# Altium schematic sheet Amp_op4.SchDoc: AmpOps de Potência
size A3; Address1: UFCG; Address2: Laboratório VIRTUS CC; Address3: Campina Grande, PB - Brasil; SheetNumber: 6; SheetTotal: 7; Project: HAT RPi 4 - Phase Shifter Fotônico; Version: v1.0; SCH_SCALE: N/A
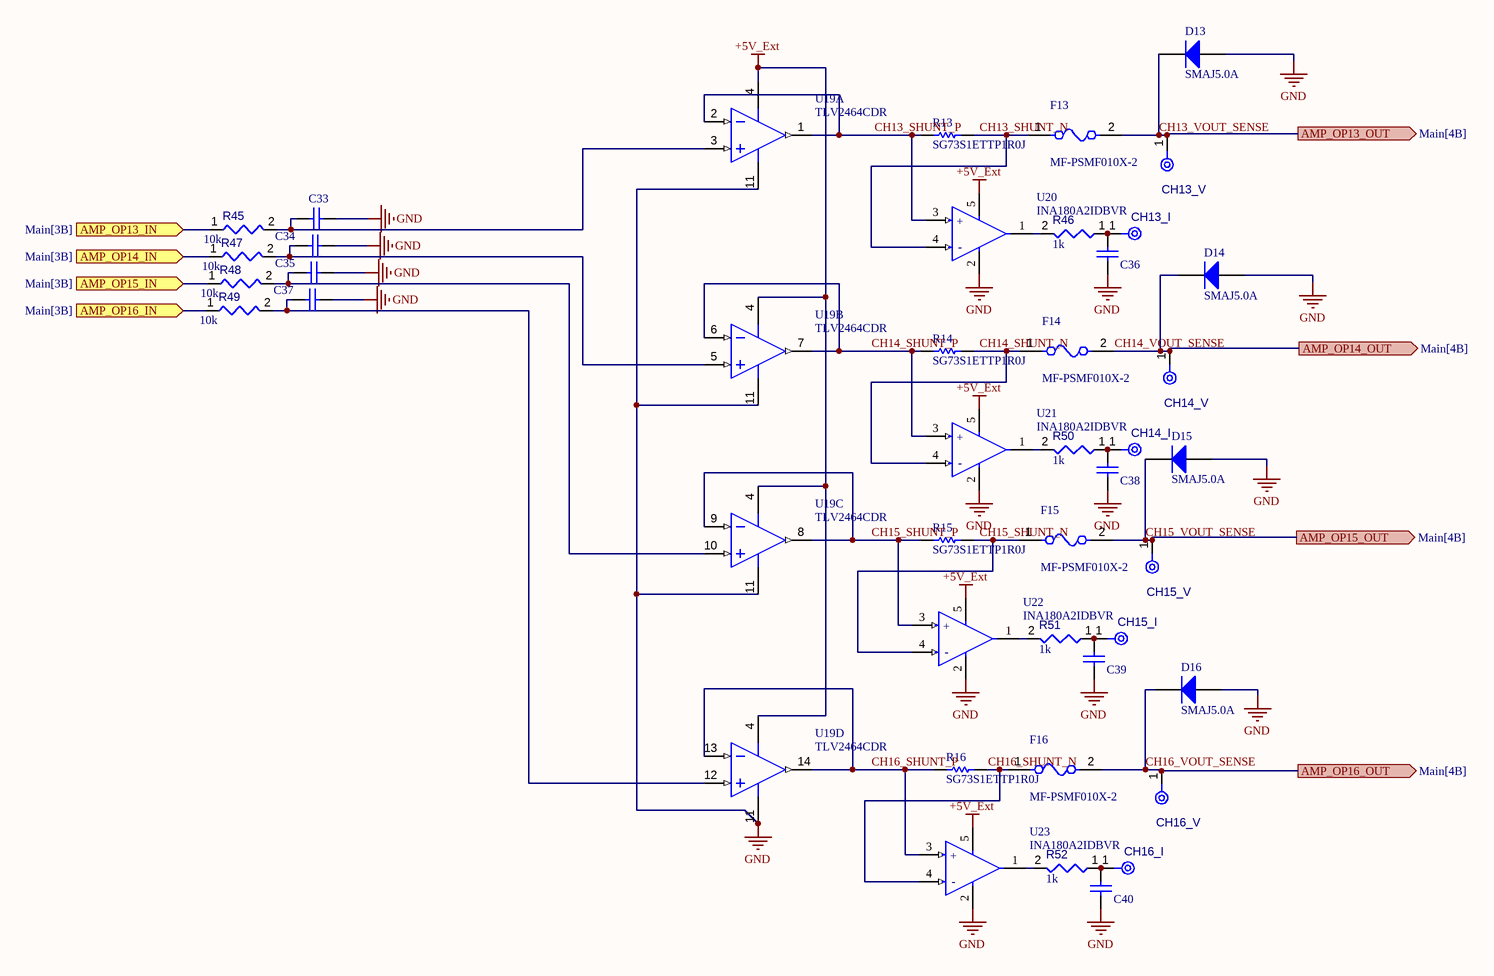
[diagram p0: Amp_op4.SchDoc]

## Parts
C33  VJ0603Y104MXJCW1BC  [CAPC1608X95X40NL15T15]  (value not drawn)
C34  VJ0603Y104MXJCW1BC  [CAPC1608X95X40NL15T15]  (value not drawn)
C35  VJ0603Y104MXJCW1BC  [CAPC1608X95X40NL15T15]  (value not drawn)
C36  VJ0603Y104MXJCW1BC  [CAPC1608X95X40NL15T15]  (value not drawn)
C37  VJ0603Y104MXJCW1BC  [CAPC1608X95X40NL15T15]  (value not drawn)
C38  VJ0603Y104MXJCW1BC  [CAPC1608X95X40NL15T15]  (value not drawn)
C39  VJ0603Y104MXJCW1BC  [CAPC1608X95X40NL15T15]  (value not drawn)
C40  VJ0603Y104MXJCW1BC  [CAPC1608X95X40NL15T15]  (value not drawn)
CH13_I  TPAD6R  [TP06R]  (value not drawn)  (no BOM)
CH13_V  TPAD6R  [TP06R]  (value not drawn)  (no BOM)
CH14_I  TPAD6R  [TP06R]  (value not drawn)  (no BOM)
CH14_V  TPAD6R  [TP06R]  (value not drawn)  (no BOM)
CH15_I  TPAD6R  [TP06R]  (value not drawn)  (no BOM)
CH15_V  TPAD6R  [TP06R]  (value not drawn)  (no BOM)
CH16_I  TPAD6R  [TP06R]  (value not drawn)  (no BOM)
CH16_V  TPAD6R  [TP06R]  (value not drawn)  (no BOM)
D13  SMAJ5.0A  [BOUR-SMA-2_V]
D14  SMAJ5.0A  [BOUR-SMA-2_V]
D15  SMAJ5.0A  [BOUR-SMA-2_V]
D16  SMAJ5.0A  [BOUR-SMA-2_V]
F13  MF-PSMF010X-2  [FP-MF-PSMF-MFG]
F14  MF-PSMF010X-2  [FP-MF-PSMF-MFG]
F15  MF-PSMF010X-2  [FP-MF-PSMF-MFG]
F16  MF-PSMF010X-2  [FP-MF-PSMF-MFG]
R13  SG73S1ETTP1R0J  [RESC1005X40X25LL10T10]
R14  SG73S1ETTP1R0J  [RESC1005X40X25LL10T10]
R15  SG73S1ETTP1R0J  [RESC1005X40X25LL10T10]
R16  SG73S1ETTP1R0J  [RESC1005X40X25LL10T10]
R45  value 10k  [RESC0603(1608)_L]  (hidden comment: Resistor 10k +/-1% 0603 100 mW)
R46  value 1k  [RESC0603(1608)_L]  (hidden comment: Resistor 1k +/-1% 0603 100 mW)
R47  value 10k  [RESC0603(1608)_L]  (hidden comment: Resistor 10k +/-1% 0603 100 mW)
R48  value 10k  [RESC0603(1608)_L]  (hidden comment: Resistor 10k +/-1% 0603 100 mW)
R49  value 10k  [RESC0603(1608)_L]  (hidden comment: Resistor 10k +/-1% 0603 100 mW)
R50  value 1k  [RESC0603(1608)_L]  (hidden comment: Resistor 1k +/-1% 0603 100 mW)
R51  value 1k  [RESC0603(1608)_L]  (hidden comment: Resistor 1k +/-1% 0603 100 mW)
R52  value 1k  [RESC0603(1608)_L]  (hidden comment: Resistor 1k +/-1% 0603 100 mW)
U19  TLV2464CDR  [D0014A_N]  (parts A,B,C,D of 4)
U20  INA180A2IDBVR  [FP-DBV0005A-MFG]
U21  INA180A2IDBVR  [FP-DBV0005A-MFG]
U22  INA180A2IDBVR  [FP-DBV0005A-MFG]
U23  INA180A2IDBVR  [FP-DBV0005A-MFG]

## Ports
AMP_OP13_IN (in, see Main[3B]), AMP_OP13_OUT (out, see Main[4B]), AMP_OP14_IN (in, see Main[3B]), AMP_OP14_OUT (out, see Main[4B]), AMP_OP15_IN (in, see Main[3B]), AMP_OP15_OUT (out, see Main[4B]), AMP_OP16_IN (in, see Main[3B]), AMP_OP16_OUT (out, see Main[4B])

## Nets
+5V_Ext: U19.4(VDD+) U20.5(VS) U21.5(VS) U22.5(VS) U23.5(VS)
GND: C33.2 C34.2 C35.2 C36.2 C37.2 C38.2 C39.2 C40.2 D13.1(A) D14.1(A) D15.1(A) D16.1(A) U19.11(GND) U20.2(GND) U21.2(GND) U22.2(GND) U23.2(GND)
AMP_OP13_IN: R45.1 ; port AMP_OP13_IN
AMP_OP14_IN: R47.1 ; port AMP_OP14_IN
AMP_OP15_IN: R48.1 ; port AMP_OP15_IN
AMP_OP16_IN: R49.1 ; port AMP_OP16_IN
CH13_SHUNT_N: F13.1 R13.2 U20.4(IN-)
CH13_SHUNT_P: R13.1 U19.1(OUT1) U19.2(IN1-) U20.3(IN+)
CH13_VOUT_SENSE: CH13_V.1(TP) D13.2(K) F13.2 ; port AMP_OP13_OUT
CH14_SHUNT_N: F14.1 R14.2 U21.4(IN-)
CH14_SHUNT_P: R14.1 U19.6(IN2-) U19.7(OUT2) U21.3(IN+)
CH14_VOUT_SENSE: CH14_V.1(TP) D14.2(K) F14.2 ; port AMP_OP14_OUT
CH15_SHUNT_N: F15.1 R15.2 U22.4(IN-)
CH15_SHUNT_P: R15.1 U19.8(OUT3) U19.9(IN3-) U22.3(IN+)
CH15_VOUT_SENSE: CH15_V.1(TP) D15.2(K) F15.2 ; port AMP_OP15_OUT
CH16_SHUNT_N: F16.1 R16.2 U23.4(IN-)
CH16_SHUNT_P: R16.1 U19.13(IN4-) U19.14(OUT4) U23.3(IN+)
CH16_VOUT_SENSE: CH16_V.1(TP) D16.2(K) F16.2 ; port AMP_OP16_OUT
NetC33_1: C33.1 R45.2 U19.3(IN1+)
NetC34_1: C34.1 R47.2 U19.5(IN2+)
NetC35_1: C35.1 R48.2 U19.10(IN3+)
NetC36_1: C36.1 CH13_I.1(TP) R46.1
NetC37_1: C37.1 R49.2 U19.12(IN4+)
NetC38_1: C38.1 CH14_I.1(TP) R50.1
NetC39_1: C39.1 CH15_I.1(TP) R51.1
NetC40_1: C40.1 CH16_I.1(TP) R52.1
NetR46_2: R46.2 U20.1(OUT)
NetR50_2: R50.2 U21.1(OUT)
NetR51_2: R51.2 U22.1(OUT)
NetR52_2: R52.2 U23.1(OUT)

## Notes on the sheet
- REVISION
- DESCRIPTION
- DATE
- APPROVED
- ADDRESS
- PROJECT
- VERSION
- TITLE
- A3
- SIZE
- SCALE
- DOCUMENT NAME:
- DOCUMENT REVISION:
- OF
- SHEET:
- PROJECT REVISION:
- (in symbol CMP-04895-000287-1) +; -

## Library data of the parts
C33-C40 = CMP-2006-00058-1: Manufacturer: Vitramon; Part Number: VJ0603Y104MXJCW1BC
CH13_I CH13_V CH14_I CH14_V CH15_I CH15_V CH16_I CH16_V = CMP-00028-00002-2: 0.6mm round; Pins: 1; Component Type: Mechanical
D13-D16 = CMP-2000-07090-1: SMAJ Transient Voltage Suppressor Diode Series, 3.5 V, -55 to 150 degC, 2-Pin SMA, RoHS, Tape and Reel; Manufacturer: Bourns; EDA / CAD Models: DownloadfromAcceleratedDesigns; Unidirectional Channels: 1; Voltage - Breakdown (Min): 6.4V; Voltage - Reverse Standoff (Typ): 5V; Voltage - Clamping (Max) @ Ipp: 9.2V; Other Names: SMAJ5.0ABDKR; Type: Zener; Catalog Drawings: SMAJSeriesFootprintSMAJ,SMBJSeries; Featured Product: SMAJ/SMBJ/SMCJ/SMLJDiscreteTVSDiodes; Power - Peak Pulse: 400W; Current - Peak Pulse (10/1000µs): 43.5A; Power Line Protection: No; Online Catalog: SMAJSeries; Supplier Device Package: SMA(DO-214AC); Operating Temperature: -55°C~150°C(TJ); Package Description: 2-Pin Surface Mount Device, Body 4.315 x 2.605 mm; Datasheet URL: https://datasheet.ciiva.com/25624/0900766b8112213b-25624680.pdf; Manufacturer URL: http://www.bourns.com/; Datasheet Version: 08/2012; Series: SMAJ; Family: TVS-Diodes; Bidirectional Channels: -; Applications: GeneralPurpose; Package Reference: SMA-2; Standard Package: 1; Package / Case: DO-214AC,SMA; Category: CircuitProtection; RoHS Information: SMAJSeriesMaterialDeclaration; Mounting Technology: SurfaceMount; Capacitance @ Frequency: -; Packaging: Digi-Reel®; Mounting Type: SurfaceMount
F13-F16 = CMP-07400-000017-1: PTC RESET FUSE 15V 100MA 0805; Manufacturer: Bourns Inc.; Resistance: 1-7.5Ω; Value: 1-7.5Ω; Current Rating: 40A; Hold Current: 0.1A; Trip Current: 0.3A; Trip Time: 1.5s; Temperature: -40°C to +85°C; ComponentLink2Description: Datasheet; Lead Free: Yes; Ipc Land Pattern Name: CAPC215135X67; Device Class L1: Circuit Protection; Mouser Description: Resettable Fuses - PPTC 0.10A 15V 1ohm; Automotive: No; Octopart: https://octopart.com/mf-psmf010x-2-bourns-7483441; Manufacturer Part Number: MF-PSMF010X-2; RoHS: TRUE; Temperature Range High: +85°C; Digikey Description: PTC RESET FUSE 15V 100MA 0805; Device Class L3: unset; ComponentLink2URL: https://www.bourns.com/docs/Product-Datasheets/mfpsmf.pdf; Height: 0.85mm; Voltage Rating: 15V; Ambient Temperature Range Low: -40°C; Category: Fuse; Package: MF-PSMF; Temperature Range Low: -40°C; Device Class L2: PTC Resettable Fuses; Ambient Temperature Range High: +85°C
R13-R16 = CMP-2002-04124-1: Manufacturer: KOA Speer; Part Number: SG73S1ETTP1R0J
R45 R47-R49 = CMP-009-00017-7: Chip Resistor, 10 KOhm, +/- 1%, 01 W, -55 to 155 degC, 0603 (1608 Metric); Manufacturer: Vishay; Manufacturer Part Number: CRCW060310K0FKEA; Voltage Rating: 50V; Power: 100mW; RoHS Compliant: True; Min Operating Temperature: -55°C; Pins: 2; Case/Package: 0603; Mounting Technology: SM; Max Operating Temperature: 155°C; Tolerance: 1%; Component Type: Resistors
R46 R50-R52 = CMP-009-00014-6: Chip Resistor, 1 KOhm, +/-1%, 0.1 W, -55 to 155 degC, 0603 (1608 Metric); Manufacturer: Yageo; Manufacturer Part Number: RC0603FR-131KL; Power: 100mW; Tolerance: 1%; Voltage Rating: 50V; Mounting Technology: SM; Case/Package: 0603; Min Operating Temperature: -55°C; RoHS Compliant: True; Max Operating Temperature: 155°C; Pins: 2; Component Type: Resistors
U19 = CMP-0271-00006-3: Quad Low Power, Rail-to-Rail Input / Output Operational Amplifier, 2.7 to 6 V, 0 to 70 degC, 14-pin SOIC (D14), Green (RoHS & no Sb/Br); Manufacturer: Texas Instruments; Offset Drift(Typ)(uV/C): 2; Total Supply Voltage(Min)(+5V is 5, +/-5V is 10): 2.7; IIB(Max)(pA): 14000; CMRR(Min)(dB): 66; Iq per channel(Max)(mA): 0.575; Vn at 1kHz(Typ)(nV/rtHz): 11; Slew Rate(Typ)(V/us): 1.6; Number of Channels: 4; Sub Family: High Output Current Amplifier (>=50mA), Low Supply Voltage Amplifier (<=2.7V), Precision Amplifier; Total Supply Voltage(Max)(+5V is 5, +/-5V is 10): 6; ComponentLink3URL: http://www.ti.com/lit/ml/mpds177g/mpds177g.pdf; ComponentLink1Description: Manufacturer URL; PackageReference: D0014A; Vio (25C)(Max)(mV): 2; Mounting Technology: Surface Mount; PackageDescription: 14-Pin Plastic Small Outline, Body 8.65 x 3.9 mm, Pitch 1.27 mm; ComponentLink2Description: Datasheet; ComponentLink3Description: Package Specification; ComponentLink1URL: http://www.ti.com/; DatasheetVersion: SLOS220J; PartNumber: TLV2464CDR; Code_JEDEC: MS-012; PackageVersion: 4040047-5/M, 06/2011; ComponentLink2URL: http://www.ti.com/general/docs/lit/getliterature.tsp?genericPartNumber=TLV2464&fileType=pdf; Eco-Plan: Green (RoHS & no Sb/Br)
U20-U23 = CMP-04895-000287-1: IC CURR SENSE 1 CIRCUIT SOT23-5; Operating Supply Current: 260uA; -3db Bandwidth: 350kHz; Slew Rate: 2V/µs; Number of Circuits: 1; Input Offset Voltage (Vos): 100uV; Input Bias Current: 100nA; Mount: Surface Mount; Max Operating Temperature: 125°C; Packaging: Tape and Reel; Min Operating Temperature: -40°C; Case/Package: SOT-23-5; RoHS Compliant: Yes